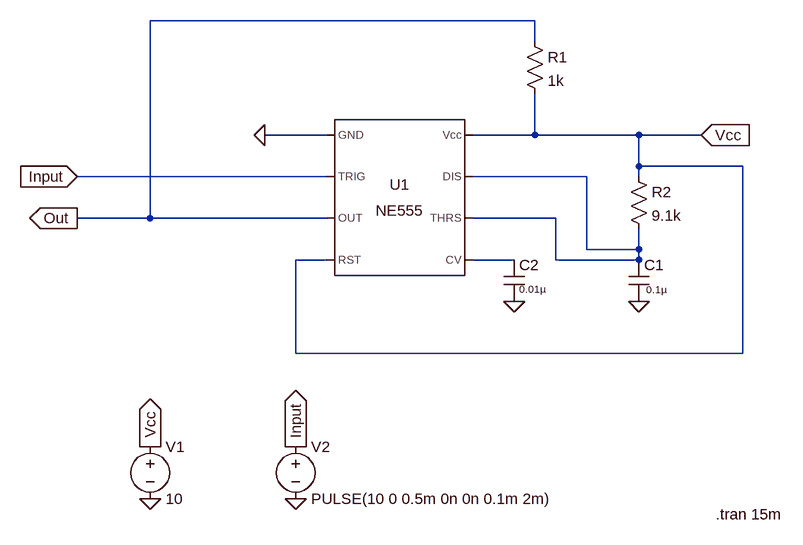
[diagram p0: schematic P3.asc]
P3.asc, the LTspice schematic file:
Version 4
SHEET 1 880 696
WIRE 416 -80 -176 -80
WIRE 416 -48 416 -80
WIRE 96 96 0 96
WIRE 416 96 416 32
WIRE 416 96 320 96
WIRE 576 96 416 96
WIRE 672 96 576 96
WIRE 576 144 576 96
WIRE 736 144 576 144
WIRE 96 160 -288 160
WIRE 496 160 320 160
WIRE 576 160 576 144
WIRE -176 224 -176 -80
WIRE -176 224 -288 224
WIRE 96 224 -176 224
WIRE 448 224 320 224
WIRE 496 272 496 160
WIRE 576 272 576 240
WIRE 576 272 496 272
WIRE 96 288 48 288
WIRE 384 288 320 288
WIRE 448 288 448 224
WIRE 576 288 576 272
WIRE 576 288 448 288
WIRE 48 432 48 288
WIRE 736 432 736 144
WIRE 736 432 48 432
FLAG 672 96 Vcc
IOPIN 672 96 In
FLAG -288 224 Out
IOPIN -288 224 Out
FLAG 576 352 0
FLAG 384 352 0
FLAG 0 96 0
FLAG -288 160 Input
IOPIN -288 160 In
FLAG -176 576 Vcc
IOPIN -176 576 Out
FLAG -176 656 0
FLAG 48 576 Input
IOPIN 48 576 Out
FLAG 48 656 0
SYMBOL Misc\\NE555 208 192 R0
SYMATTR InstName U1
SYMBOL res 400 -64 R0
SYMATTR InstName R1
SYMATTR Value 1k
SYMBOL res 560 144 R0
SYMATTR InstName R2
SYMATTR Value 9.1k
SYMBOL cap 560 288 R0
WINDOW 3 27 46 Left 1
SYMATTR InstName C1
SYMATTR Value 0.1µ
SYMBOL cap 368 288 R0
WINDOW 3 24 45 Left 1
SYMATTR InstName C2
SYMATTR Value 0.01µ
SYMBOL voltage -176 560 R0
WINDOW 123 0 0 Left 0
WINDOW 39 0 0 Left 0
SYMATTR InstName V1
SYMATTR Value 10
SYMBOL voltage 48 560 R0
WINDOW 123 0 0 Left 0
WINDOW 39 0 0 Left 0
SYMATTR InstName V2
SYMATTR Value PULSE(10 0 0.5m 0n 0n 0.1m 2m)
TEXT 694 680 Left 2 !.tran 15m

The netlist it stands for:
* P3.asc
XU1 0 Input Out Vcc N002 N001 N001 Vcc NE555  ; pins GND TRIG OUT RST CV THRS DIS Vcc
R1 Out Vcc 1k
R2 Vcc N001 9.1k
C1 N001 0 0.1µ
C2 N002 0 0.01µ
V1 Vcc 0 10
V2 Input 0 PULSE(10 0 0.5m 0n 0n 0.1m 2m)
.tran 15m
.lib NE555.sub
.backanno
.end